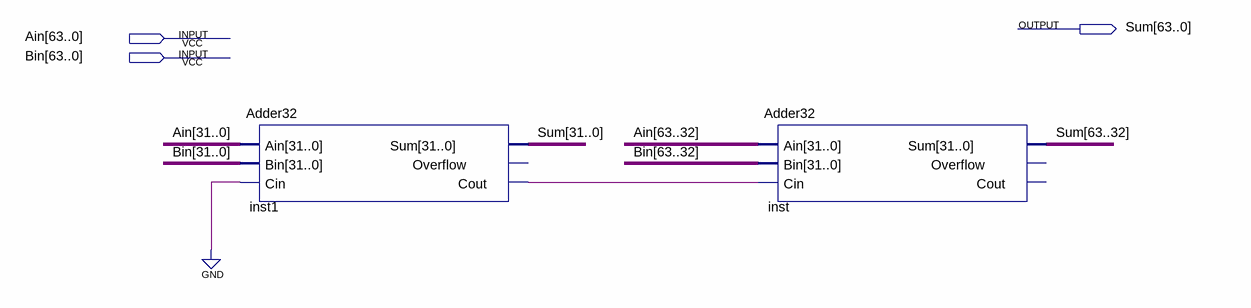
[diagram p0: schematic sheet]
// Quartus schematic MulAdder64.bdf as structural Verilog: 2 symbols, 3 pins
module MulAdder64 (
  input  [63:0] Ain,
  input  [63:0] Bin,
  output [63:0] Sum
);

  wire inst1_cout;

  Adder32 inst1 (.Ain(Ain[31:0]), .Bin(Bin[31:0]), .Cin(1'b0), .Sum(Sum[31:0]), .Cout(inst1_cout));  // open: Overflow
  Adder32 inst (.Ain(Ain[63:32]), .Bin(Bin[63:32]), .Cin(inst1_cout), .Sum(Sum[63:32]));  // open: Overflow, Cout
endmodule
